# EAGLE design 4017_with_555_and_relay_driver (EAGLE 6.1)
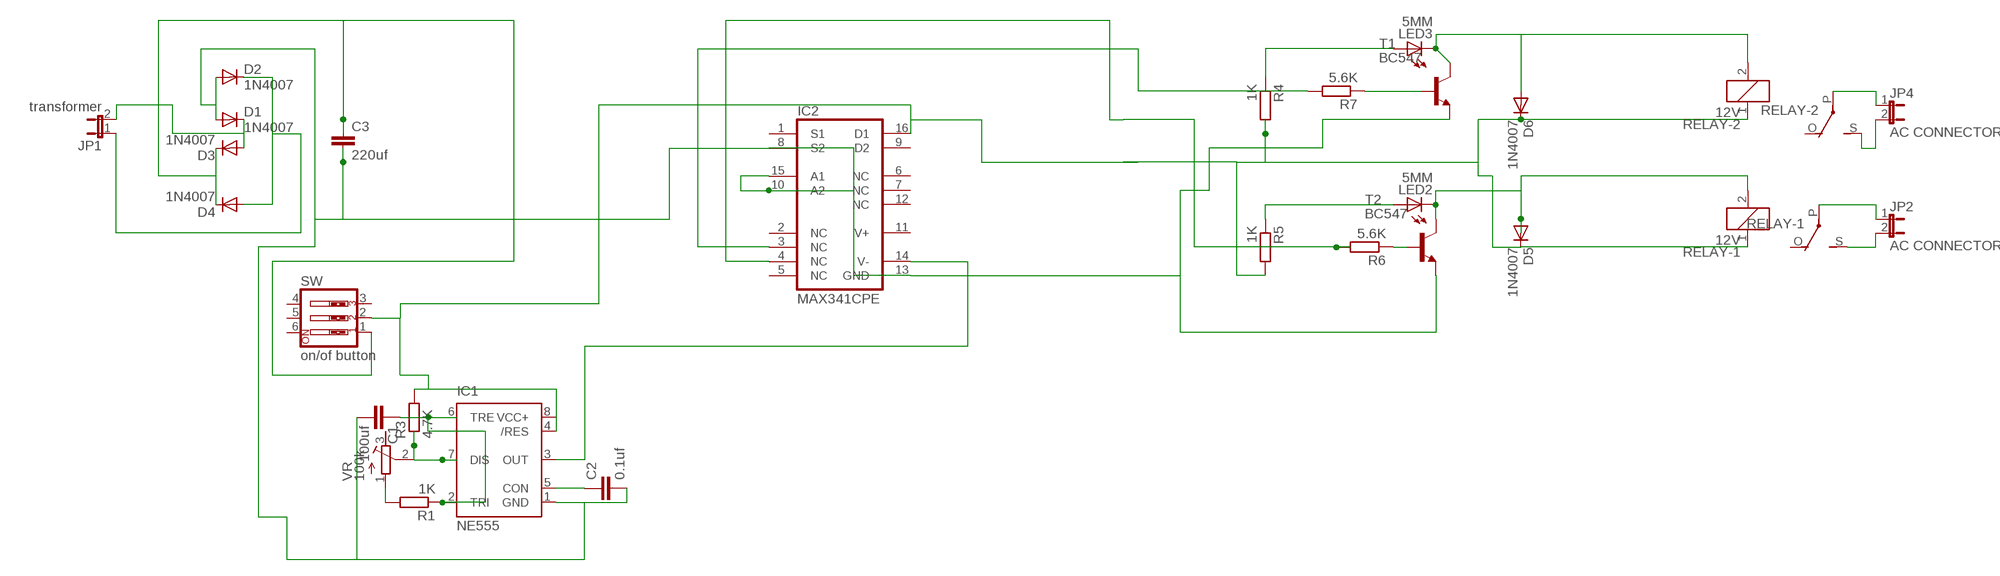
[diagram p0: schematic, sheet 1]

## Parts
C1  100uf  C-EU025-050X050  [C025-050X050]
C2  0.1uf  C-EU025-050X050  [C025-050X050]
C3  220uf  C5/7.2  [C5B7.2]
D1  1N4007  1N4004  [DO41-10]
D2  1N4007  1N4004  [DO41-10]
D3  1N4007  1N4004  [DO41-10]
D4  1N4007  1N4004  [DO41-10]
D5  1N4007  1N4004  [DO41-10]
D6  1N4007  1N4004  [DO41-10]
IC1  NE555  [DIL-08]
IC2  MAX341CPE  [DIL16]
JP1  transformer  JP1E  [JP1]
JP2  AC CONNECTOR  JP1E  [JP1]
JP4  AC CONNECTOR  JP1E  [JP1]
LED2  5MM  LED5MM  [LED5MM]
LED3  5MM  LED5MM  [LED5MM]
R1  1K  R-EU_0204/7  [0204/7]
R3  4.7K  R-EU_0204/7  [0204/7]
R4  1K  R-EU_0204/7  [0204/7]
R5  1K  R-EU_0204/7  [0204/7]
R6  5.6K  R-EU_0204/7  [0204/7]
R7  5.6K  R-EU_0204/7  [0204/7]
RELAY-1  12V  G5L  [G5LE]
RELAY-2  12V  G5L  [G5LE]
SW  on/of button  SW_DIP-3  [EDG-03]
T1  BC547  [TO92]
T2  BC547  [TO92]
VR  100k  R-TRIMM64P  [RTRIM64P]

## Nets
N$1: C1.1 IC1.2(TRI) IC1.6(TRE) R1.1
N$2: C2.1 IC1.5(CON)
N$3: IC1.7(DIS) R3.1 VR.2(S)
N$4: IC1.3(OUT) IC2.14(V-)
N$5: IC1.4(/RES) IC1.8(VCC+) IC2.16(D1) R3.2 SW.2
N$6: D5.C D6.C R4.2 R5.2 RELAY-1.1 RELAY-2.1
N$7: R1.2 VR.1(E)
N$9: C1.2 C2.2 C3.2 D1.A D2.A IC1.1(GND) IC2.8(S2) IC2.10(A2) IC2.13(GND) IC2.15(A1) T1.1(E) T2.1(E)
N$10: C3.1 D3.C D4.C SW.1
N$12: D2.C D4.A JP1.1
N$13: D1.C D3.A JP1.2
N$15: D5.A LED2.K(C) RELAY-1.2 T2.3(C)
N$17: R7.1 T1.2(B)
N$18: R6.1 T2.2(B)
N$19: LED2.A R5.1
N$20: LED3.A R4.1
N$21: JP2.2 RELAY-1.S(2:S)
N$22: JP2.1 RELAY-1.P(2:P)
N$24: JP4.2 RELAY-2.S(2:S)
N$25: JP4.1 RELAY-2.P(2:P)
N$28: IC2.4(NC) R6.2
N$29: IC2.3(NC) R7.2
N$30: D6.A LED3.K(C) RELAY-2.2 T1.3(C)
Unconnected: IC2.1(S1) IC2.2(NC) IC2.5(NC) IC2.6(NC) IC2.7(NC) IC2.9(D2) IC2.12(NC) RELAY-1.O(2:O) RELAY-2.O(2:O) SW.3 SW.4 SW.5 SW.6 VR.3(A)

## Power pins joined to a net without a drawn wire
V+: IC2.11(V+)

## Library data of the parts
C1 C2 = rcl:C-EU: CAPACITOR, European symbol
C3 = capacitor-wima:C: CAPACITOR naming: grid - package width
D1-D6 = diode:1N4004: DIODE general purpose rectifier, 1 A
IC1 = st-microelectronics:NE555: General purpose bipolar Timer; MF: Arrow Electronics; MPN: NE555N; OC_FARNELL: 1467742; OC_NEWARK: 89K1486
IC2 = maxim:MAX341CPE: ANALOG SWITCH; OC_FARNELL: unknown; OC_NEWARK: unknown
JP1 JP2 JP4 = jumper:JP1E: JUMPER
LED2 LED3 = led:LED: LED OSRAM: - CHIPLED LG R971, LG N971, LY N971, LG Q971, LY Q971, LO R971, LY R971 LH N974, LH R974 LS Q976, LO Q976, LY Q976 LO Q996 - Hyper CHIPLED LW Q18S LB Q993, LB Q99A, LB R99A - SideLED LS A670, LO A670, LY A670, LG A670, LP A670 LB A673, LV A673, LT A673, LW A673 LH A674 LY A675 LS A676, LA A676, LO A676, LY A676, LW A676 LS A679, LY A679, LG A679 - Hyper Micro SIDELED® LS Y876, LA Y876, LO Y876, LY Y876 LT Y87S - SmartLED LW L88C, LW L88S LB L89C, LB L89S, LG L890 LS L89K, LO L89K, LY L89K LS L896, LA L896, LO L896, LY L896 - TOPLED LS T670, LO T670, LY T670, LG T670, LP T670 LSG T670, LSP T670, LSY T670, LOP T670, LYG T670 LG T671, LOG T671, LSG T671 LB T673, LV T673, LT T673, LW T673 LH T674 LS T676, LA T676, LO T676, LY T676, LB T676, LH T676, LSB T676, LW T676 LB T67C, LV T67C, LT T67C, LS T67K, LO T67K, LY T67K, LW E67C LS E67B, LA E67B, LO E67B, LY E67B, LB E67C, LV E67C, LT E67C LW T67C LS T679, LY T679, LG T679 LS T770, LO T770, LY T770, LG T770, LP T770 LB T773, LV T773, LT T773, LW T773 LH T774 LS E675, LA E675, LY E675, LS T675 LS T776, LA T776, LO T776, LY T776, LB T776 LHGB T686 LT T68C, LB T68C - Hyper Mini TOPLED® LB M676 - Mini TOPLED Santana® LG M470 LS M47K, LO M47K, LY M47K Source: http://www.osram.convergy.de LUXEON: - LUMILED® LXK2-PW12-R00, LXK2-PW12-S00, LXK2-PW14-U00, LXK2-PW14-V00 LXK2-PM12-R00, LXK2-PM12-S00, LXK2-PM14-U00 LXK2-PE12-Q00, LXK2-PE12-R00, LXK2-PE12-S00, LXK2-PE14-T00, LXK2-PE14-U00 LXK2-PB12-K00, LXK2-PB12-L00, LXK2-PB12-M00, LXK2-PB14-N00, LXK2-PB14-P00, LXK2-PB14-Q00 LXK2-PR12-L00, LXK2-PR12-M00, LXK2-PR14-Q00, LXK2-PR14-R00 LXK2-PD12-Q00, LXK2-PD12-R00, LXK2-PD12-S00 LXK2-PH12-R00, LXK2-PH12-S00 LXK2-PL12-P00, LXK2-PL12-Q00, LXK2-PL12-R00 Source: www.luxeon.com KINGBRIGHT: KA-3528ASYC Source: www.kingbright.com
R1 R3-R7 = rcl:R-EU_: RESISTOR, European symbol
RELAY-1 RELAY-2 = relay:G5L: RELAY 1 x switch, 10 A/120 V AC, 8 A/30 V ADC, Omron; OC_FARNELL: unknown; OC_NEWARK: unknown
SW = special:SW_DIP-3: DIP SWITCH
T1 T2 = transistor:BC547: NPN TRANSISTOR
VR = resistor:R-TRIMM: Trimm resistor

## Board
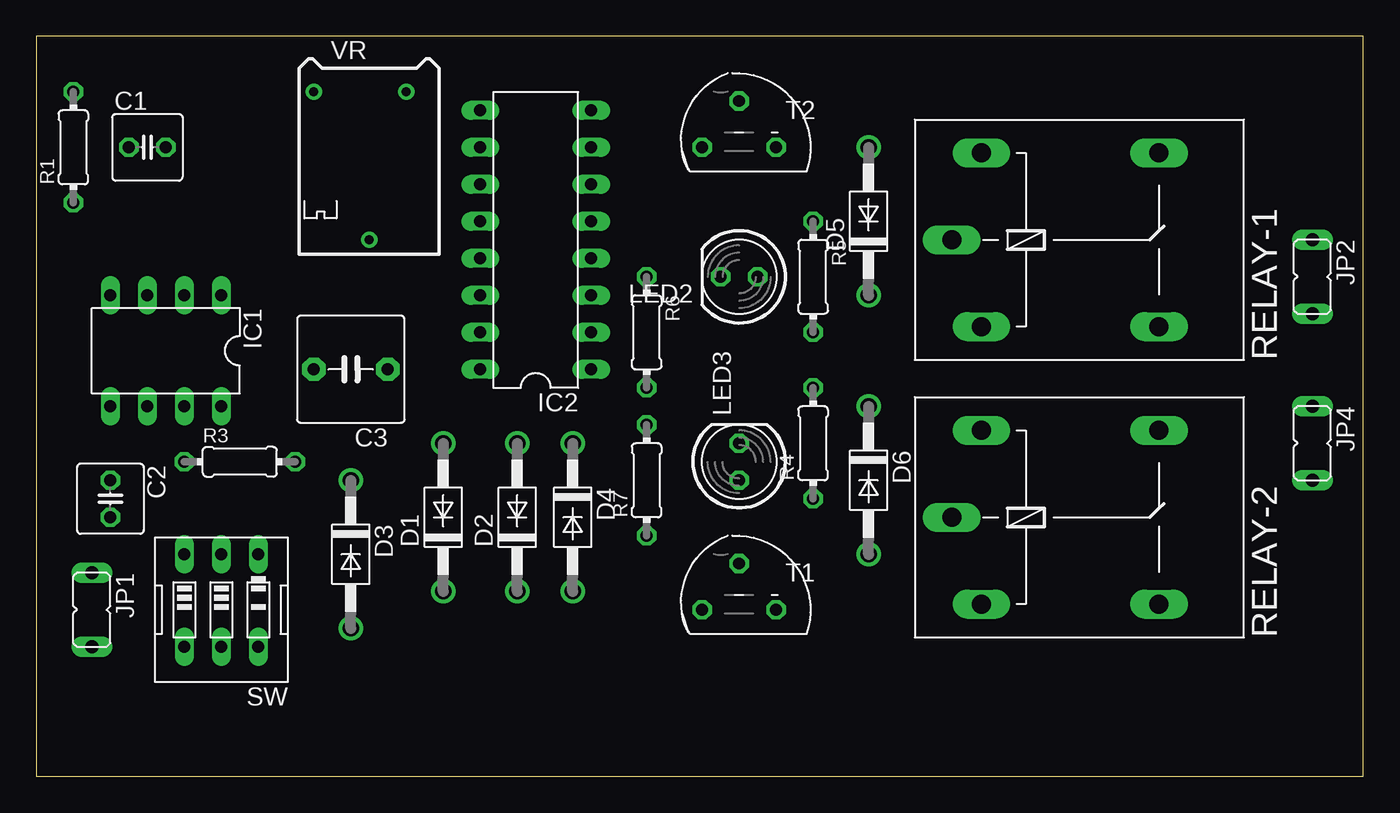
[diagram p1: board, top side]
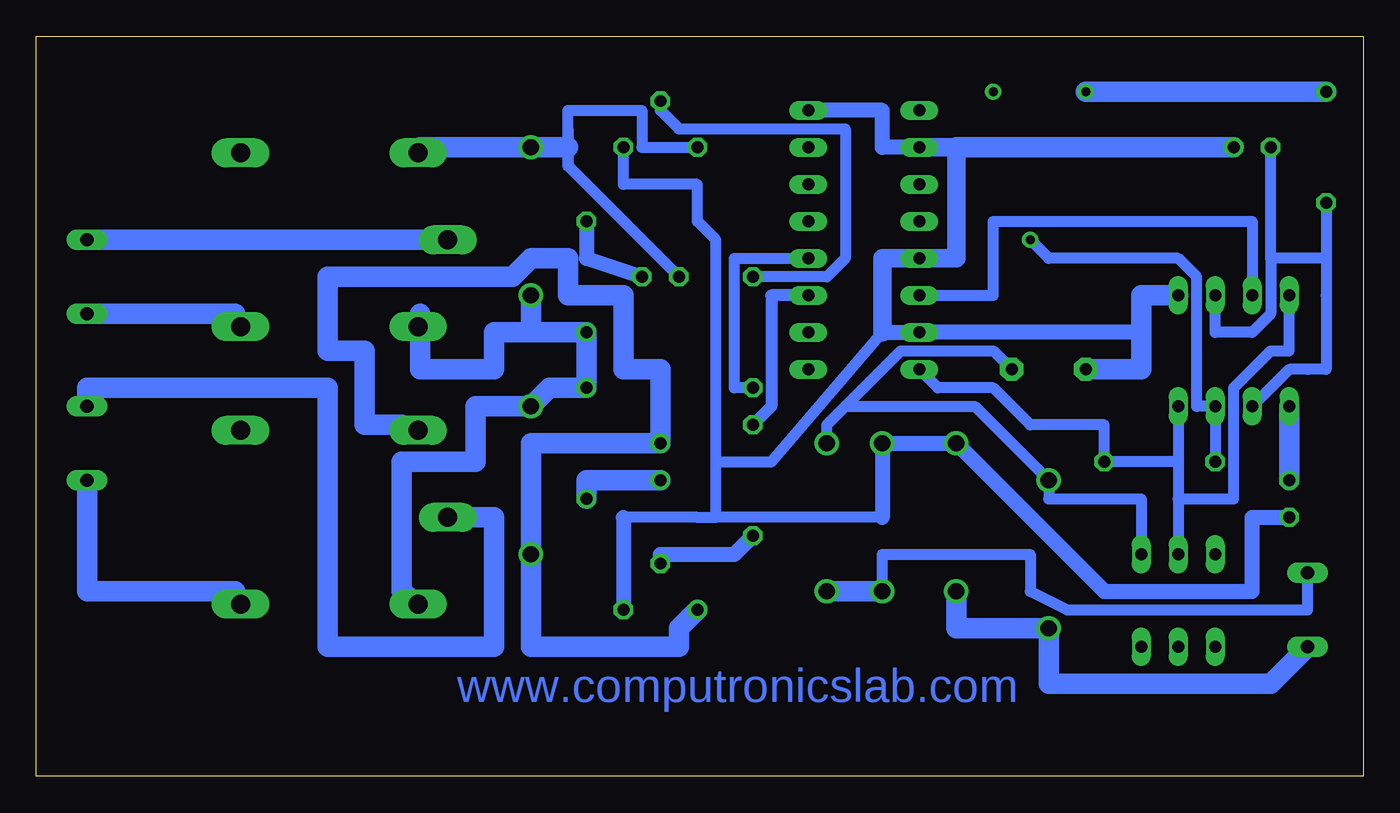
[diagram p2: board, bottom side, seen from below]

Size 91.11 x 50.79 mm. Coordinates in mm from the lower left corner, seen from the top.
Outline: 0,0 91.11,0 91.11,50.79 0,50.79 0,0
Copper layers (1*16): Top 0.035mm / dielectric 1.5mm / Bottom 0.035mm
Design rules: minimum track width 30mil, minimum drill 24mil, track to track 8mil, track to pad 8mil, pad to pad 8mil, via to via 8mil, smd to smd 8mil, copper to edge 40mil, drill to drill 8mil, minimum pad ring 10mil, minimum via ring 8mil, stop-mask expansion 4mil, vias tented up to drill 0mil, thermal gap 10mil

### Footprints (pad centres in the part's own frame; a part is rotated, then mirrored left to right if it is on the bottom)
C025-050X050 = drill 0.813 octagon: 1 -1.27,0; 2 1.27,0
C5B7.2 = drill 0.813 pad 1.6 octagon: 1 -2.54,0; 2 2.54,0
DO41-10 = drill 1.118: A 5.08,0; C -5.08,0
DIL-08 = drill 0.813 long: 1 -3.81,-3.81; 2 -1.27,-3.81; 3 1.27,-3.81; 4 3.81,-3.81; 5 3.81,3.81; 6 1.27,3.81; 7 -1.27,3.81; 8 -3.81,3.81
DIL16 = drill 0.813 long: 1 -8.89,-3.81; 2 -6.35,-3.81; 3 -3.81,-3.81; 4 -1.27,-3.81; 5 1.27,-3.81; 6 3.81,-3.81; 7 6.35,-3.81; 8 8.89,-3.81; 9 8.89,3.81; 10 6.35,3.81; 11 3.81,3.81; 12 1.27,3.81; 13 -1.27,3.81; 14 -3.81,3.81; 15 -6.35,3.81; 16 -8.89,3.81
JP1 = drill 0.914 long: 1 0,-2.54; 2 0,2.54
LED5MM = drill 0.813 octagon: A -1.27,0; K 1.27,0
0204/7 = drill 0.813 octagon: 1 -3.81,0; 2 3.81,0
G5LE = drill 1.321 long: 1 -7.493,-5.969; 2 -7.493,5.969; O 4.699,5.969; P -9.525,0; S 4.699,-5.969
EDG-03 = drill 0.813 long: 1 -2.54,-3.81; 2 0,-3.81; 3 2.54,-3.81; 4 2.54,2.54; 5 0,2.54; 6 -2.54,2.54
TO92 = drill 0.813 octagon: 1 2.54,-1.27; 2 0,1.905; 3 -2.54,-1.27
RTRIM64P = drill 0.61: 1 -2.54,-3.81; 2 7.62,0; 3 -2.54,2.54

### Placement (x,y rotation side)
C1  7.62,43.18 0 top
C2  5.08,19.05 270 top
C3  21.59,27.94 180 top
D1  27.94,17.78 90 top
D2  33.02,17.78 90 top
D3  21.59,15.24 270 top
D4  36.83,17.78 270 top
D5  57.15,38.1 90 top
D6  57.15,20.32 270 top
IC1  8.89,29.21 180 top
IC2  34.29,36.83 90 top
JP1  3.81,11.43 180 top
JP2  87.63,34.29 180 top
JP4  87.63,22.86 180 top
LED2  48.26,34.29 180 top
LED3  48.26,21.59 90 top
R1  2.54,43.18 90 top
R3  13.97,21.59 0 top
R4  53.34,22.86 90 top
R5  53.34,34.29 270 top
R6  41.91,30.48 270 top
R7  41.91,20.32 90 top
RELAY-1  72.39,36.83 0 top
RELAY-2  72.39,17.78 0 top
SW  12.7,11.43 180 top
T1  48.26,12.7 0 top
T2  48.26,44.45 0 top
VR  22.86,44.45 270 top

### Tracks (layer width: path | path; a pad name or v marks a point on that pad's centre or on a via)
N$1
  Bottom 0.762: IC1.6 5.08,27.94 3.81,27.94 2.54,27.94 2.54,33.02 2.54,35.56 | R1.1 2.54,35.56 | IC1.2 10.16,30.48 7.62,30.48 6.35,31.75 6.35,35.56 | 2.54,35.56 6.35,35.56 | 6.35,35.56 C1.1
N$2
  Bottom 1.422: IC1.5 C2.1
N$3
  Bottom 0.762: VR.2 21.59,35.56 12.7,35.56 11.43,34.29 11.43,25.4 IC1.7 R3.1
N$4
  Bottom 0.762: IC1.3 7.62,38.1 25.4,38.1 25.4,33.02 IC2.14
N$5
  Bottom 0.762: IC1.8 12.7,21.59 | 12.7,21.59 12.7,19.05 | 12.7,19.05 SW.2 | 12.7,21.59 R3.2 17.78,24.13 22.86,24.13 25.4,26.67 29.21,26.67 IC2.16 | IC1.4 5.08,29.21 6.35,29.21 8.89,26.67 8.89,19.05 12.7,19.05
N$6
  Bottom 0.762: 64.77,31.75 RELAY-1.1
  Bottom 1.422: 57.15,30.48 R5.2 R4.2 55.88,26.67 D6.C 60.96,25.4 60.96,24.13 60.96,21.59 66.04,21.59 66.04,12.7 RELAY-2.1 | 64.77,31.75 64.77,27.94 59.69,27.94 59.69,30.48 57.15,30.48 | D5.C 57.15,30.48
N$7
  Bottom 1.422: R1.2 VR.1
N$9
  Bottom 0.762: 33.02,17.78 44.45,17.78 | 50.8,17.78 45.72,17.78 44.45,17.78 | T2.1 50.8,40.64 45.72,40.64 45.72,38.1 44.45,36.83 44.45,21.59 | 44.45,17.78 44.45,21.59 | 33.02,30.48 40.64,21.59 44.45,21.59
  Bottom 1.016: 15.24,30.48 IC2.15 33.02,30.48 | IC2.8 33.02,45.72 33.02,43.18 IC2.10 | C2.2 7.62,17.78 7.62,12.7 17.78,12.7 D1.A D2.A 33.02,17.78 | 50.8,17.78 T1.1
  Bottom 1.27: IC2.10 27.94,43.18 27.94,35.56 IC2.13 33.02,35.56 33.02,30.48
  Bottom 1.422: C3.2 15.24,27.94 15.24,30.48 15.24,33.02 IC1.1 | 27.94,43.18 C1.2
N$10
  Bottom 0.762: SW.1 15.24,19.05 21.59,19.05 D3.C 26.67,25.4 35.56,25.4 | C3.1 25.4,29.21 31.75,29.21 35.56,25.4 | 35.56,25.4 36.83,24.13 D4.C
N$12
  Bottom 0.762: JP1.1 3.81,11.43 6.35,11.43 20.32,11.43 22.86,12.7 22.86,15.24 24.13,15.24 30.48,15.24 33.02,15.24 33.02,13.97 D2.C
  Bottom 1.422: D2.C D4.A
N$13
  Bottom 1.422: JP1.2 6.35,6.35 17.78,6.35 21.59,6.35 21.59,7.62 D3.A 25.4,10.16 27.94,10.16 D1.C
N$15
  Bottom 0.762: 54.61,43.18 54.61,44.45 54.61,41.91 | 54.61,41.91 LED2.K | T2.3 48.26,43.18 49.53,43.18 49.53,45.72 52.07,45.72 54.61,45.72 54.61,43.18 | 54.61,41.91 54.61,43.18
  Bottom 1.422: 54.61,43.18 55.88,43.18 D5.A 64.77,43.18 RELAY-1.2
N$17
  Bottom 1.016: R7.1 43.18,15.24 48.26,15.24 T1.2
N$18
  Bottom 0.762: R6.1 36.83,34.29 35.56,35.56 35.56,44.45 46.99,44.45 48.26,45.72 T2.2
N$19
  Bottom 1.016: R5.1 53.34,35.56 LED2.A
N$20
  Bottom 1.422: LED3.A 53.34,20.32 R4.1
N$21
  Bottom 1.422: JP2.2 77.47,31.75 RELAY-1.S
N$22
  Bottom 1.422: RELAY-1.P JP2.1
N$24
  Bottom 1.422: JP4.2 87.63,15.24 87.63,12.7 80.01,12.7 77.47,12.7 RELAY-2.S
N$25
  Bottom 1.422: JP4.1 87.63,26.67 71.12,26.67 71.12,8.89 59.69,8.89 59.69,17.78 RELAY-2.P
N$28
  Bottom 0.762: IC2.4 43.18,35.56 43.18,26.67 R6.2
N$29
  Bottom 0.813: R7.2 40.64,25.4 40.64,33.02 IC2.3
N$30
  Bottom 1.422: T1.3 46.99,10.16 46.99,8.89 57.15,8.89 D6.A 57.15,22.86 LED3.K 48.26,27.94 50.8,27.94 50.8,33.02 54.61,33.02 54.61,35.56 57.15,35.56 58.42,34.29 71.12,34.29 71.12,29.21 68.58,29.21 68.58,24.13 66.04,24.13 RELAY-2.2

### Text on the board
Bottom: www.computronicslab.com